# Altium schematic sheet RemoteSCH.SchDoc
size A4; SheetNumber: 1; SheetTotal: 1; SPICEModelCacheLTIJKMDQ: <root> / <DocumentId>LTIJKMDQ</DocumentId> / <CacheFrame Number="0"> / <Model Name="led0" Kind="MDL"> / <Text>*Typ INFRARED GaAs LED: Vf=1.2V Vr=5V If=40mA trr=3uS / *LED Pinout: 1=A, 2=K / .MODEL LED0 D (IS=93.5P RS=84M N=2.63 BV=5 IBV=10U / + CJO=2.97P VJ=.75 M=.333 TT=4.32U)</Text> / </Model> / </CacheFrame> / </root>
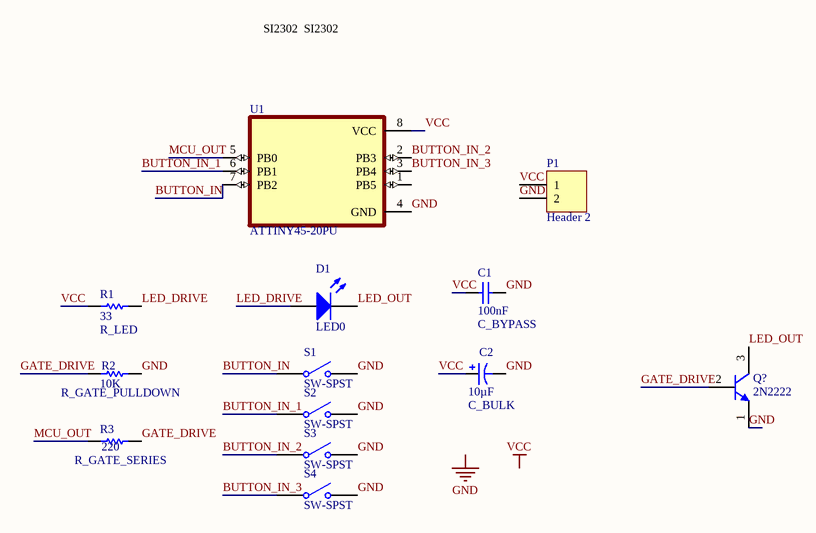
[diagram p0: RemoteSCH.SchDoc]

## Parts
C1  C_BYPASS  value 100nF  [RAD-0.3]
C2  C_BULK  value 10µF  [RB7.6-15]
D1  LED0  [LED-0]
P1  Header 2  [HDR1X2]
Q?  2N2222  [ONSC-TO-92-3-29-11_AM_BL]
R1  R_LED  value 33  [AXIAL-0.3]
R2  R_GATE_PULLDOWN  value 10K  [AXIAL-0.3]
R3  R_GATE_SERIES  value 220  [AXIAL-0.3]
S1  SW-SPST  [SPST-2]
S2  SW-SPST  [SPST-2]
S3  SW-SPST  [SPST-2]
S4  SW-SPST  [SPST-2]
U1  ATTINY45-20PU  [DIP787W46P254L927H533Q8]

## Nets
GND: C1.2 C2.2 P1.2 Q?.1(E) R2.2 S1.2(NO) S2.2(NO) S3.2(NO) S4.2(NO) U1.4(GND)
VCC: C1.1 C2.1 P1.1 R1.1 U1.8(VCC)
BUTTON_IN: S1.1(COMMON) U1.7(PB2)
BUTTON_IN_1: S2.1(COMMON) U1.6(PB1)
BUTTON_IN_2: S3.1(COMMON) U1.2(PB3)
BUTTON_IN_3: S4.1(COMMON) U1.3(PB4)
GATE_DRIVE: Q?.2(B) R2.1 R3.2
LED_DRIVE: D1.1(A) R1.2
LED_OUT: D1.2(K) Q?.3(C)
MCU_OUT: R3.1 U1.5(PB0)

Not connected (* = marked no-connect by the designer): U1 1(PB5)

## Notes on the sheet
- SI2302
- Labels drawn without touching a wire or pin: GND, VCC

## Library data of the parts
C1 = Cap: Capacitor; Published: 8-Jun-2000; LatestRevisionDate: 17-Jul-2002; LatestRevisionNote: Re-released for DXP Platform.; PackageReference: RAD-0.3; Publisher: Altium Limited; PackageDescription: Radial Cap, Thru-Hole; 2 Leads; 0.3 in Pin Spacing
C2 = Cap Pol1: Polarized Capacitor (Radial); Published: 8-Jun-2000; LatestRevisionDate: 17-Jul-2002; LatestRevisionNote: Re-released for DXP Platform.; PackageReference: RB7.6-15; Publisher: Altium Limited; PackageDescription: Polarized Capacitor (Radial); 2 Leads
D1 = LED0: Typical INFRARED GaAs LED; Published: 8-Jun-2000; LatestRevisionDate: 08-Jul-2005; LatestRevisionNote: Mech Layer 1 removed.; PackageReference: LED-0; Publisher: Altium Limited; PackageDescription: LED; 2 Leads
P1 = Header 2: Header, 2-Pin; LatestRevisionDate: 17-Jul-2002; LatestRevisionNote: Re-released for DXP Platform.; Publisher: Altium Limited
Q? = CMP-1048-01601-1: Amplifier Transistor, NPN Silicon, 3-Pin TO-92, Pb-Free, Ammo Box; PartNumber: BC548BZL1G; Manufacturer: On Semiconductor; fT Min (MHz): 150; IC Continuous (A): 0.1; ComponentLink1Description: Manufacturer URL; PackageReference: TO-92-3-29-11_AM_BL; ComponentLink2Description: Datasheet; PackageDescription: 3-Pin Transistor Outline, Body 4.825 x 3.685 mm, Pitch 1.27 mm; Packing: Ammo Box; RoHS: TRUE; PackageVersion: Rev. AM; ComponentLink2URL: http://www.onsemi.com/pub_link/Collateral/BC546-D.PDF; DatasheetVersion: Rev. 7; Mounting Technology: Through Hole; Polarity: NPN; ComponentLink1URL: http://www.onsemi.com/; ComponentLink3Description: Package Specification; ComponentLink3URL: http://www.onsemi.com/pub_link/Collateral/MAC97-D.PDF
R1-R3 = Res1: Resistor; Published: 8-Jun-2000; LatestRevisionDate: 17-Jul-2002; LatestRevisionNote: Re-released for DXP Platform.; PackageReference: AXIAL-0.3; Publisher: Altium Limited; PackageDescription: Axial Device, Thru-Hole; 2 Leads; 0.3 in Pin Spacing
S1-S4 = SW-SPST: Single-Pole, Single-Throw Switch; Published: 24-Mar-1999; LatestRevisionDate: 17-Jul-2002; LatestRevisionNote: Re-released for DXP Platform.; PackageReference: SPST-2; Publisher: Altium Limited; PackageDescription: Switch; 2 Leads
U1 = ATTINY45-20PU: Package: None; Price: None; Value: *; MP: ATTINY45-20PU; Availability: Unavailable